# EAGLE schematic wattcher_to_rpi (EAGLE 7.1.0)
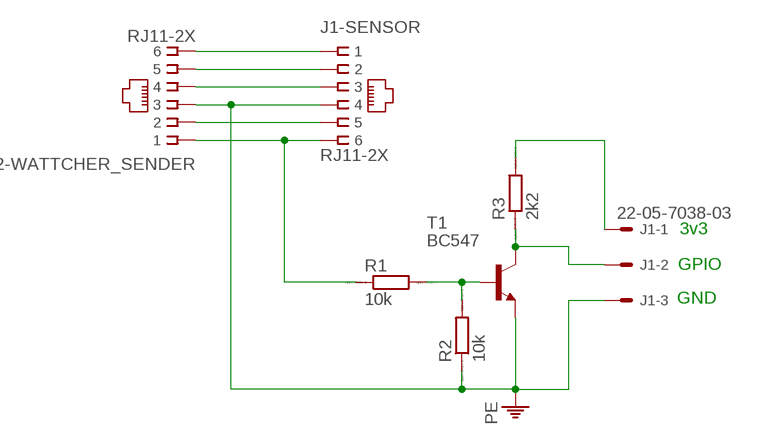
[diagram p0: schematic, sheet 1]

## Parts
J1  22-05-7038-03  [7395-03]
J1-SENSOR  RJ11-2X  [RJ11-NO_SHIELD]
J2-WATTCHER_SENDER  RJ11-2X  [RJ11-NO_SHIELD]
R1  10k  R-EU_0207_7  [0207/7]
R2  10k  R-EU_0207_7  [0207/7]
R3  2k2  R-EU_0207_7  [0207/7]
T1  BC547  [TO92]

## Nets
N$1: J1.2 R3.1 T1.3(C)
N$2: R1.2 R2.2 T1.2(B)
N$3: J1-SENSOR.5 J2-WATTCHER_SENDER.2
N$4: J1.1 R3.2
N$6: J1-SENSOR.3 J2-WATTCHER_SENDER.4
N$7: J1-SENSOR.2 J2-WATTCHER_SENDER.5
N$8: J1-SENSOR.6 J2-WATTCHER_SENDER.1 R1.1
N$9: J1-SENSOR.1 J2-WATTCHER_SENDER.6
PE: J1-SENSOR.4 J1.3 J2-WATTCHER_SENDER.3 R2.1 T1.1(E)

## Notes on the sheet
- 3v3
- GPIO
- GND

## Library data of the parts
J1 = con-molex:22-?-03: CONNECTOR wire to board 2.54 mm (.1 inch) pitch header; OC_FARNELL: unknown; OC_NEWARK: unknown
J1-SENSOR J2-WATTCHER_SENDER = con-tycoelectronics:RJ11: CORCOM Modular RJ Jacks No Shield Source: www.tycoelectronics.com .. ENG_DS_1654001_1099_RJ_L_0507.pdf; OC_FARNELL: unknown; OC_NEWARK: unknown
R1-R3 = resistor:R-EU_: RESISTOR, European symbol; SPICEPREFIX: R
T1 = transistor:BC547: NPN TRANSISTOR